# Altium schematic sheet Sheet1.SchDoc
size A3; SheetNumber: 1; SheetTotal: 1
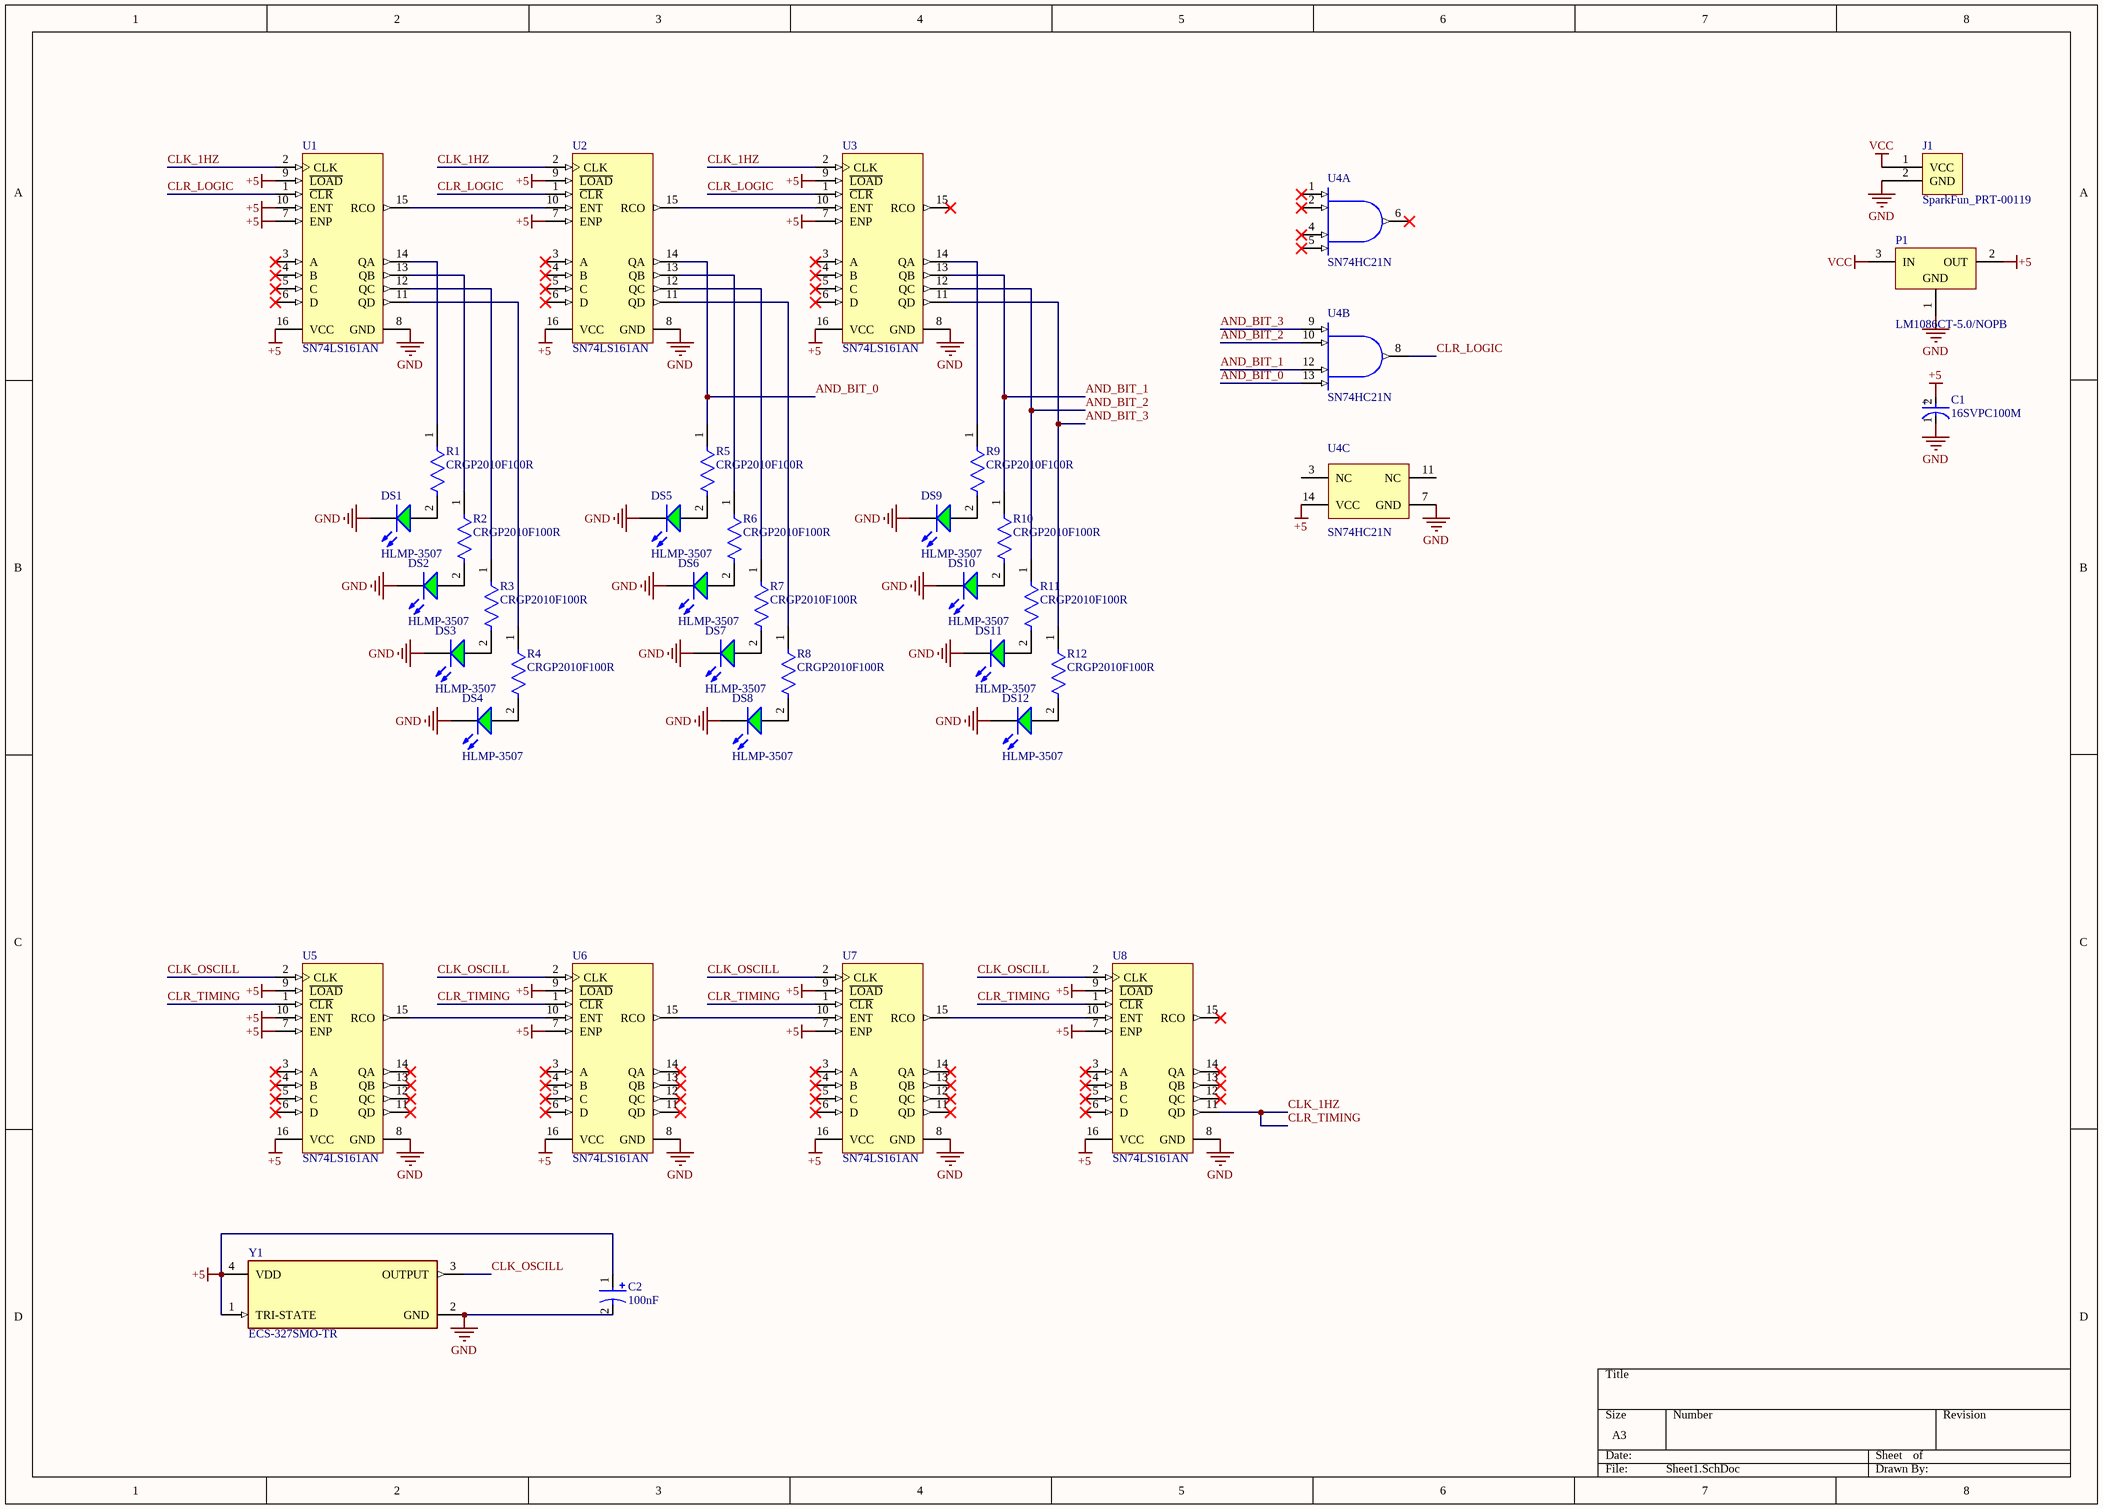
[diagram p0: Sheet1.SchDoc]

## Parts
C1  16SVPC100M  [FP-OS-CON-SMT-C6-MFG]
C2  value 100nF  [WurthElektronik_885012208030-Footprint-1]  (hidden comment: WurthElektronik_885012208030)
DS1  HLMP-3507  [AVAG-HLMP-3507]
DS2  HLMP-3507  [AVAG-HLMP-3507]
DS3  HLMP-3507  [AVAG-HLMP-3507]
DS4  HLMP-3507  [AVAG-HLMP-3507]
DS5  HLMP-3507  [AVAG-HLMP-3507]
DS6  HLMP-3507  [AVAG-HLMP-3507]
DS7  HLMP-3507  [AVAG-HLMP-3507]
DS8  HLMP-3507  [AVAG-HLMP-3507]
DS9  HLMP-3507  [AVAG-HLMP-3507]
DS10  HLMP-3507  [AVAG-HLMP-3507]
DS11  HLMP-3507  [AVAG-HLMP-3507]
DS12  HLMP-3507  [AVAG-HLMP-3507]
J1  SparkFun_PRT-00119  [SparkFun_PRT-00119-Footprint-1]
P1  LM1086CT-5.0/NOPB  [NDE0003A]
R1  CRGP2010F100R  [FP-CRGP2010-IPC_C]
R2  CRGP2010F100R  [FP-CRGP2010-IPC_C]
R3  CRGP2010F100R  [FP-CRGP2010-IPC_C]
R4  CRGP2010F100R  [FP-CRGP2010-IPC_C]
R5  CRGP2010F100R  [FP-CRGP2010-IPC_C]
R6  CRGP2010F100R  [FP-CRGP2010-IPC_C]
R7  CRGP2010F100R  [FP-CRGP2010-IPC_C]
R8  CRGP2010F100R  [FP-CRGP2010-IPC_C]
R9  CRGP2010F100R  [FP-CRGP2010-IPC_C]
R10  CRGP2010F100R  [FP-CRGP2010-IPC_C]
R11  CRGP2010F100R  [FP-CRGP2010-IPC_C]
R12  CRGP2010F100R  [FP-CRGP2010-IPC_C]
U1  SN74LS161AN  [N0016A]
U2  SN74LS161AN  [N0016A]
U3  SN74LS161AN  [N0016A]
U4  SN74HC21N  [N0014A]  (parts A,B,C of 3)
U5  SN74LS161AN  [N0016A]
U6  SN74LS161AN  [N0016A]
U7  SN74LS161AN  [N0016A]
U8  SN74LS161AN  [N0016A]
Y1  ECS-327SMO-TR  [FP-327SMO-MFG]

## Nets
+5: C1.2(A) C2.1 P1.2(OUT) U1.7(ENP) U1.9(~{LOAD}) U1.10(ENT) U1.16(VCC) U2.7(ENP) U2.9(~{LOAD}) U2.16(VCC) U3.7(ENP) U3.9(~{LOAD}) U3.16(VCC) U4.14(VCC) U5.7(ENP) U5.9(~{LOAD}) U5.10(ENT) U5.16(VCC) U6.7(ENP) U6.9(~{LOAD}) U6.16(VCC) U7.7(ENP) U7.9(~{LOAD}) U7.16(VCC) U8.7(ENP) U8.9(~{LOAD}) U8.16(VCC) Y1.1(TRI-STATE) Y1.4(VDD)
GND: C1.1(C) C2.2 DS1.2(K) DS2.2(K) DS3.2(K) DS4.2(K) DS5.2(K) DS6.2(K) DS7.2(K) DS8.2(K) DS9.2(K) DS10.2(K) DS11.2(K) DS12.2(K) J1.2(GND) P1.1(GND) U1.8(GND) U2.8(GND) U3.8(GND) U4.7(GND) U5.8(GND) U6.8(GND) U7.8(GND) U8.8(GND) Y1.2(GND)
VCC: J1.1(VCC) P1.3(IN)
AND_BIT_0: R5.1 U2.14(QA) U4.13(2D)
AND_BIT_1: R10.1 U3.13(QB) U4.12(2C)
AND_BIT_2: R11.1 U3.12(QC) U4.10(2B)
AND_BIT_3: R12.1 U3.11(QD) U4.9(2A)
CLK_1HZ: U1.2(CLK) U2.2(CLK) U3.2(CLK) U5.1(~{CLR}) U6.1(~{CLR}) U7.1(~{CLR}) U8.1(~{CLR}) U8.11(QD)  [also labelled CLR_TIMING]
CLK_OSCILL: U5.2(CLK) U6.2(CLK) U7.2(CLK) U8.2(CLK) Y1.3(OUTPUT)
CLR_LOGIC: U1.1(~{CLR}) U2.1(~{CLR}) U3.1(~{CLR}) U4.8(2Y)
NetDS1_1: DS1.1(A) R1.2
NetDS2_1: DS2.1(A) R2.2
NetDS3_1: DS3.1(A) R3.2
NetDS4_1: DS4.1(A) R4.2
NetDS5_1: DS5.1(A) R5.2
NetDS6_1: DS6.1(A) R6.2
NetDS7_1: DS7.1(A) R7.2
NetDS8_1: DS8.1(A) R8.2
NetDS9_1: DS9.1(A) R9.2
NetDS10_1: DS10.1(A) R10.2
NetDS11_1: DS11.1(A) R11.2
NetDS12_1: DS12.1(A) R12.2
NetR1_1: R1.1 U1.14(QA)
NetR2_1: R2.1 U1.13(QB)
NetR3_1: R3.1 U1.12(QC)
NetR4_1: R4.1 U1.11(QD)
NetR6_1: R6.1 U2.13(QB)
NetR7_1: R7.1 U2.12(QC)
NetR8_1: R8.1 U2.11(QD)
NetR9_1: R9.1 U3.14(QA)
NetU1_15: U1.15(RCO) U2.10(ENT)
NetU2_15: U2.15(RCO) U3.10(ENT)
NetU5_15: U5.15(RCO) U6.10(ENT)
NetU6_15: U6.15(RCO) U7.10(ENT)
NetU7_15: U7.15(RCO) U8.10(ENT)

Not connected (* = marked no-connect by the designer): U1 3(A)* 4(B)* 5(C)* 6(D)*; U2 3(A)* 4(B)* 5(C)* 6(D)*; U3 3(A)* 4(B)* 5(C)* 6(D)* 15(RCO)*; U4 1(1A)* 2(1B)* 3(NC) 4(1C)* 5(1D)* 6(1Y)* 11(NC); U5 3(A)* 4(B)* 5(C)* 6(D)* 11(QD)* 12(QC)* 13(QB)* 14(QA)*; U6 3(A)* 4(B)* 5(C)* 6(D)* 11(QD)* 12(QC)* 13(QB)* 14(QA)*; U7 3(A)* 4(B)* 5(C)* 6(D)* 11(QD)* 12(QC)* 13(QB)* 14(QA)*; U8 3(A)* 4(B)* 5(C)* 6(D)* 12(QC)* 13(QB)* 14(QA)* 15(RCO)*

## Notes on the sheet
- (in symbol CMP-05428-000037-2) +

## Library data of the parts
C1 = CMP-05428-000037-2: Conductive Polymer Aluminum Solid Capacitors (OS-CON) 100uF ±20% 16V; Ripple Current: 2.49A; Leakage Current: 300uA; Life (Hours): 2000Hour; ESR (Equivalent Series Resistance): 24mR; Polarity: Polar; Dissipation Factor: 12%; Voltage Rating: 16V; Max Operating Temperature: 105°C; Number of Pins: 6; Case/Package: Radial; Length: 5.9mm; Termination: SMD/SMT; Voltage: 16V; Ripple Current (AC): 2.49A; Diameter: 6.3mm; Capacitance: 100uF; Min Operating Temperature: -55°C; Package Quantity: 1000; Series: OS-CON™, SVPC; Lead Free: Lead Free; Packaging: Tape and Reel; Height - Seated (Max): 0.236inch; REACH SVHC: No SVHC; Radiation Hardening: No; Tolerance: 20%; Mount: Surface Mount; Height: 5.9mm; RoHS Compliant: Yes; Construction: Cylindrical; Voltage Rating (DC): 16V
C2 = CMP-001-00092-1: Cap, 0.1ΜF, 16V, 10%, X7R, 1206; Case/Package: 1206; Case Code (Imperial): 1206; Case Code (Metric): 3216; Capacitance: 100nF; RoHS Compliant: Yes; Composition: Ceramic
DS1-DS12 = CMP-2000-06412-1: T-1 3/4 (5 mm) Diffused LED Lamp, Green, 2.1 V, -20 to 100 degC, 2-Pin THD, RoHS, Bulk; Manufacturer: Avago; Type: Uni-Color; Reverse Voltage: 5V; Product Depth (mm): 6.1mm; Lum Intensity: 4.2mcd; Chip Material: GaP; Emitting Color: YellowGreen; Number of  Elements: 1; Forward Voltage: 2.7V; Dominant Wave Length: 569nm; Peak Wavelength: 565nm; Rad Hardened: No; Shape Type: Circular; Forward Current: 25mA; Product Height (mm): 9.19mm; Power Dissipation: 85W; Viewing Angle: 60deg; Main Category: StandardLED; Lens Type: ColoredDiffused; Test Current (It): 10mA; DELETED: Compliant; Package Description: 2-Pin Through Hole Device, Dia 5.845 mm, Pitch 2.54 mm; Datasheet URL: http://docs.avagotech.com/docs/AV02-1558EN; Operating Temperature Classification: Industrial; Pin Count: 2; Datasheet Version: 03/2015; Operating Temp Range: -40Cto100C; Package Reference: HLMP-3507; Mounting: ThroughHole; Mounting Technology: ThroughHole; Manufacturer URL: http://www.avagotech.com/; High Brightness: No; Luminous Intensity: 4.2mcd; Package Type: T-13/4; Product Length (mm): 6.1mm; Lens Dimensions: 5.08x5.08x8.3mm
J1 = CMP-002-00115-3: Simple 6.5mm barrel jack connector; pin to pad: 2>2+3; Gender: Receptacle; Mounting Technology: THT; Manufacturer: SparkFun; Pins: 3; MPN: PRT-00119; Connector Type: Barrel
P1 = CMP-0062-02515-3: 1.5A Low Dropout Positive Regulators, 3-pin TO-220, Pb-Free; Manufacturer: Texas Instruments; PowerWise: N; CompType: LDO IC; PackageTopMarking: NSUZXYTTE#*LM1086*CT-5.0; PackageDescription: TO-220, Molded, 3 Lead, Straight; PackageReference: NDE0003A; ComponentLink1URL: http://www.ti.com/general/docs/lit/getliterature.tsp?genericPartNumber=LM1086&fileType=pdf; ComponentLink1Description: Datasheet URL; PinCount: 3; RoHS: Y
R1-R12 = CMP-03211-004382-1: CRGP2010 100Ω 1.25W ±100ppm/°C 1% 400V; Manufacturer: TE; Tolerance: 0.01; Package: CRGP2010; Temperature Coefficient: ±100ppm/°C; Resistance: 100Ω; Device Class L3: Chip SMD Resistors; Ambient Temperature Range High: +70°C; Device Class L2: Resistors; Automotive: No; Ipc Land Pattern Name: RESC500250X55; Temperature Range Low: -55°C; Temperature: -55°C to +155°C; Composition: Thick Film; Height: 0.65mm; Manufacturer Part Number: CRGP2010F100R; Series: CRGP; RoHS: TRUE; Category: Res; Power Rating: 1.25W; Value: 100Ω; ComponentLink2URL: https://www.mouser.ca/datasheet/2/418/NG_DS_9-1773463-9_A-1358566.pdf; Voltage Rating: 400V; ComponentLink2Description: Datasheet; Device Class L1: Passive Components; Octopart: https://octopart.com/crgp2010f100r-te+connectivity-91018964; Temperature Range High: +155°C; Lead Free: Yes
U1-U3 U5-U8 = CMP-1623-00512-2: Synchronous 4-Bit Binary Counters, N0016A, TUBE; Manufacturer: Texas Instruments; VCC(Max)(V): 5.25; tpd @ Nom Voltage(Max)(ns): 35; Output Type: CMOS; Input Type: TTL; ICC @ Nom Voltage(Max)(mA): 32; VCC(Min)(V): 4.75; Technology Family: LS; Voltage(Nom)(V): 5; Output Drive (IOL/IOH)(Max)(mA): 8/-0.4; Inputs: 1; Schmitt Trigger: No; Rating: Catalog; Bits(#): 4; Type: Binary; Generic Part Number: SN74LS161A; Code_JEDEC: MS-001; F @ Nom Voltage(Max)(Mhz): 35; Function: Counter; PackageReference: N0016A; DatasheetVersion: SDLS060; Operating Temperature Range(C): 0 to 70
U4 = CMP-0777-00258-3: Dual 4-Input Positive-AND Gates, N0014A, TUBE; Manufacturer: Texas Instruments; Rating: Catalog; ICC @ Nom Voltage(Max)(mA): 0.02; Bits(#): 2; VCC(Max)(V): 6; Voltage(Nom)(V): 5; Technology Family: HC; Input Type: CMOS; tpd @ Nom Voltage(Max)(ns): 28; Schmitt Trigger: No; F @ Nom Voltage(Max)(Mhz): 70; Operating Temperature Range(C): -40 to 85; DatasheetVersion: SCLS087E; PackageReference: N0014A; Generic Part Number: SN74HC21; VCC(Min)(V): 2; Output Type: CMOS
Y1 = CMP-40224-000035-1: XTAL OSC XO 32.7680KHZ CMOS SMD; Frequency: 32.768kHz; Operating Supply Voltage: 3.3V; Frequency Stability: 30ppm; Max Supply Current: 15uA; Load Capacitance: 15pF; Packaging: Tape and Reel; Mount: Surface Mount; Min Operating Temperature: -10°C; Length: 0.256inch; Case/Package: SMD/SMT; Series: ECS-327SMO; Height: 0.079inch; RoHS Compliant: Yes; Lead Free: Lead Free; Max Operating Temperature: 85°C; Termination: SMD/SMT; Package Quantity: 1; Width: 0.158inch